# Altium schematic sheet USB_PER1.SchDoc
size 594 x 420 mm; SheetNumber: 15; SheetTotal: 20
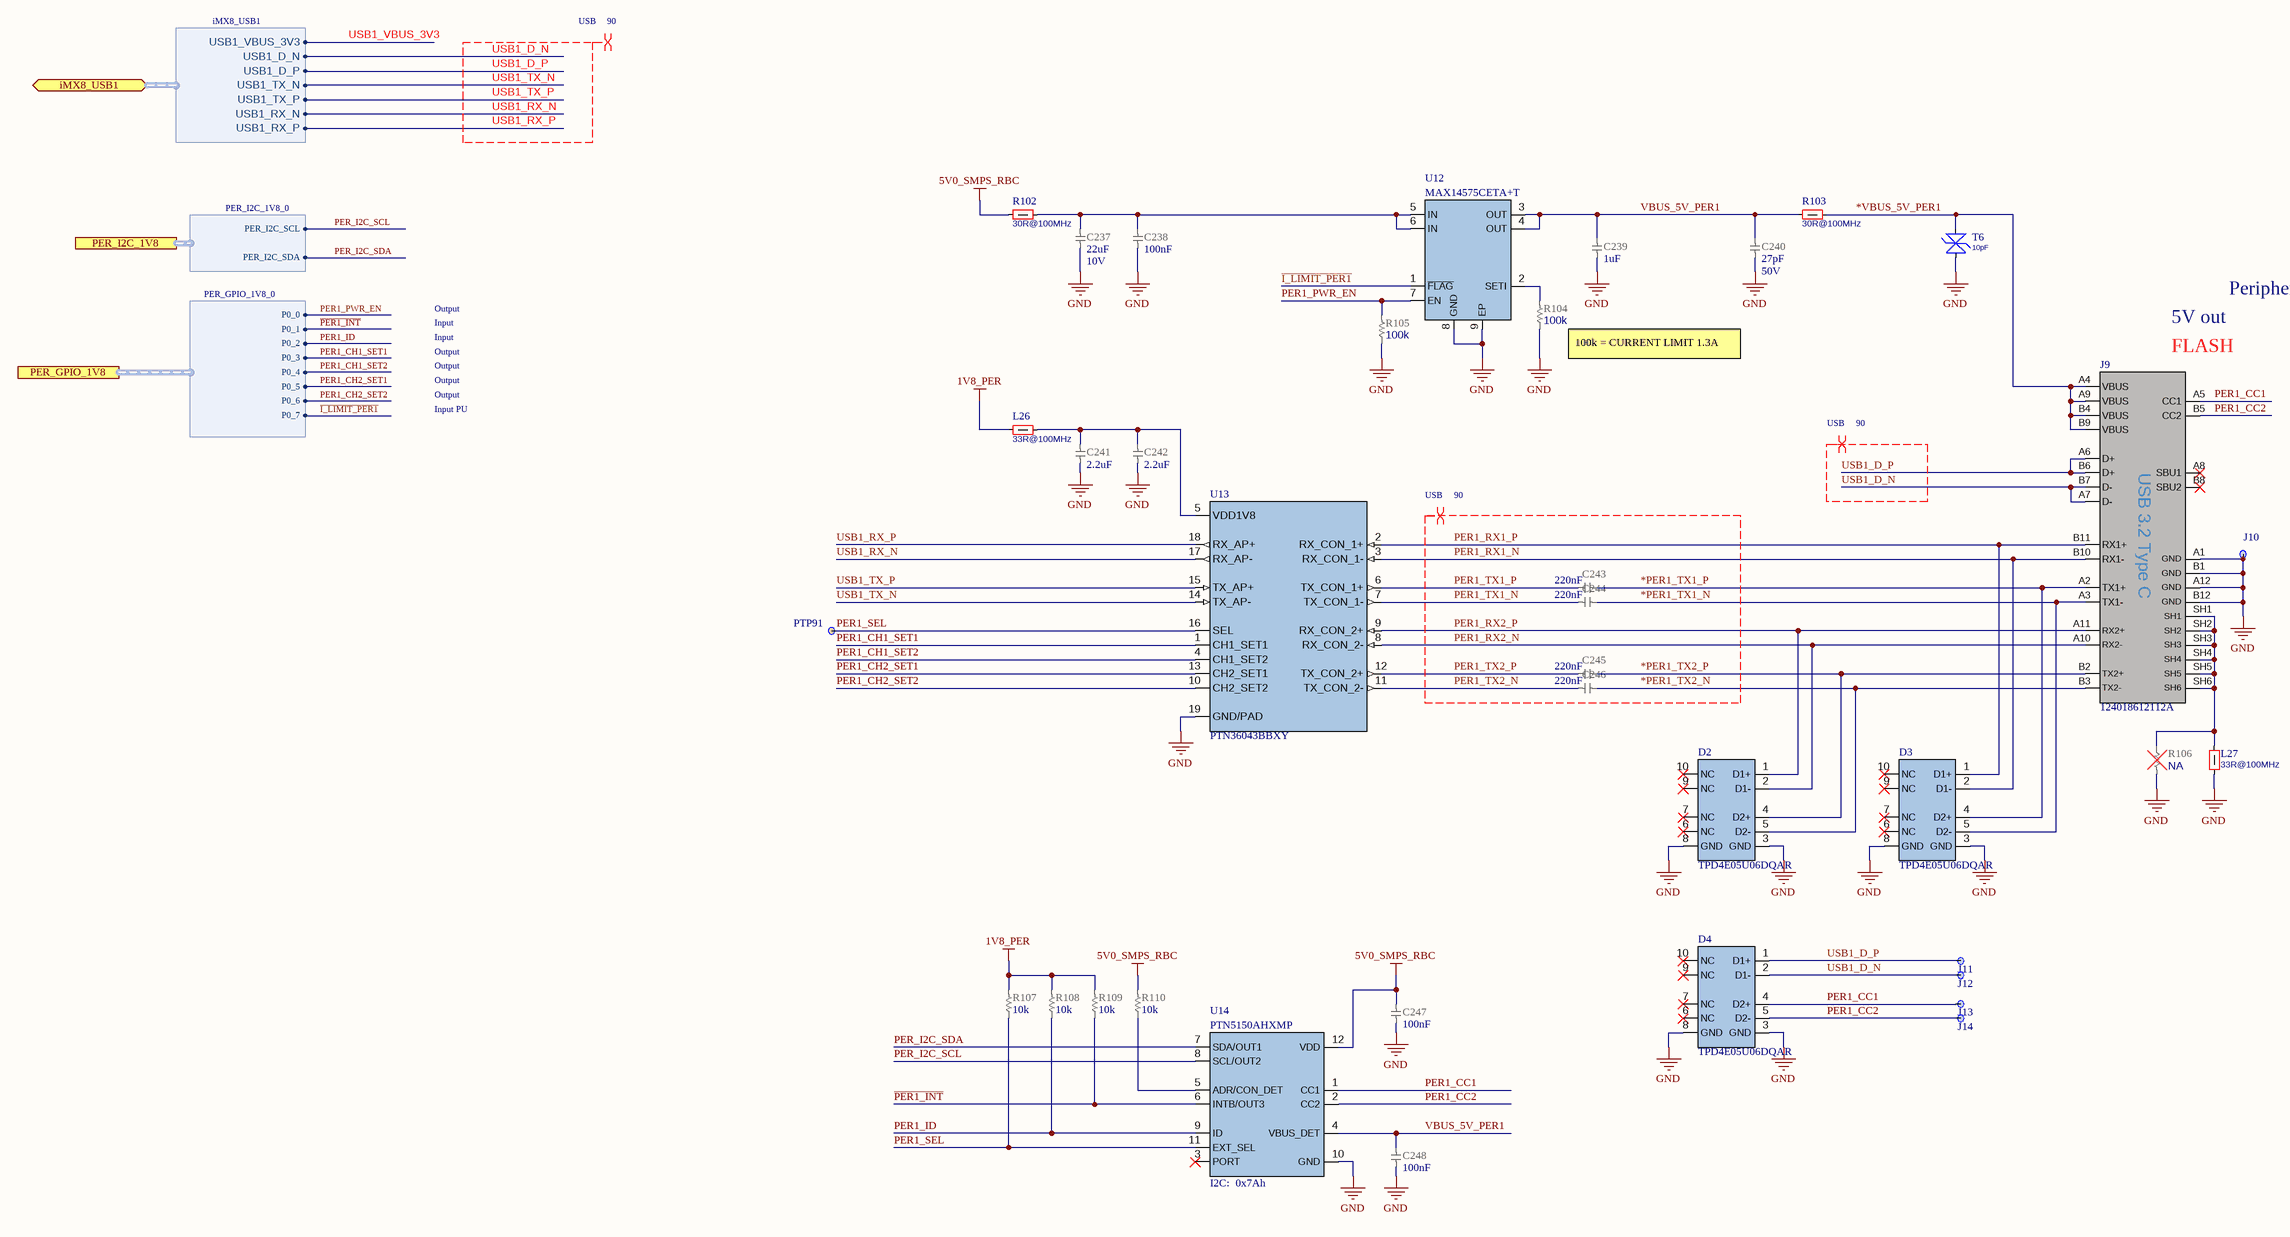
[diagram p0: USB_PER1.SchDoc]

## Parts
C237  value 22uF  Voltage: 10V  [CAP_0805_UN1Q]  (hidden comment: CAP_0805_22uF_10V_X7R)
C238  value 100nF  [CAP_0201_UN1Q]  (hidden comment: CAP_0201_100n_X7S_16V)
C239  value 1uF  [CAP_0201_UN1Q]  (hidden comment: CAP_0201_1uF_X6S)
C240  value 27pF  Voltage: 50V  [CAP_0201_UN1Q]  (hidden comment: CAP_0201_27p)
C241  value 2.2uF  [CAP_0402_H09W07_UN1Q]  (hidden comment: CAP_0402_2u2_10V_X6S)
C242  value 2.2uF  [CAP_0402_H09W07_UN1Q]  (hidden comment: CAP_0402_2u2_10V_X6S)
C243  value 220nF  [CAP_0201_UN1Q]  (hidden comment: CAP_0201_220n_10V_X6S)
C244  value 220nF  [CAP_0201_UN1Q]  (hidden comment: CAP_0201_220n_10V_X6S)
C245  value 220nF  [CAP_0201_UN1Q]  (hidden comment: CAP_0201_220n_10V_X6S)
C246  value 220nF  [CAP_0201_UN1Q]  (hidden comment: CAP_0201_220n_10V_X6S)
C247  value 100nF  [CAP_0201_UN1Q]  (hidden comment: CAP_0201_100n_X7S_16V)
C248  value 100nF  [CAP_0201_UN1Q]  (hidden comment: CAP_0201_100n_X7S_16V)
D2  TPD4E05U06DQAR  [USON10_DQA_TI]
D3  TPD4E05U06DQAR  [USON10_DQA_TI]
D4  TPD4E05U06DQAR  [USON10_DQA_TI]
J9  Part Number: 124018612112A  [USB_C_AMPHENOL_124018612112A]  (hidden comment: USB_C_AMPHENOL_124018612112A)
J10  Testpoint, Surface, 1.0mm  [TP_1mm_UN1Q]  (value not drawn)  (no BOM)
J11  Testpoint, Surface, 1.0mm  [TP_1mm_UN1Q]  (value not drawn)  (no BOM)
J12  Testpoint, Surface, 1.0mm  [TP_1mm_UN1Q]  (value not drawn)  (no BOM)
J13  Testpoint, Surface, 1.0mm  [TP_1mm_UN1Q]  (value not drawn)  (no BOM)
J14  Testpoint, Surface, 1.0mm  [TP_1mm_UN1Q]  (value not drawn)  (no BOM)
L26  value 33R@100MHz  [IND_0201_UN1Q]  (hidden comment: FERRITE_0201_BLM03_33Ohm)
L27  value 33R@100MHz  [IND_0201_UN1Q]  (hidden comment: FERRITE_0201_BLM03_33Ohm)
PTP91  PTP_0.4mm  [PTP_0.4mm]  (value not drawn)  (no BOM)
R102  value 30R@100MHz  [FERR_BLM15KD]  (hidden comment: FERRITE_0402_BLM15KD)
R103  value 30R@100MHz  [FERR_BLM15KD]  (hidden comment: FERRITE_0402_BLM15KD)
R104  value 100k  [RES_0201_UN1Q]  (hidden comment: RES_0201_100k)
R105  value 100k  [RES_0201_UN1Q]  (hidden comment: RES_0201_100k)
R106  value NA  [RES_0201_UN1Q]  (hidden comment: RES_0201_NA)
R107  value 10k  [RES_0201_UN1Q]  (hidden comment: RES_0201_10k)
R108  value 10k  [RES_0201_UN1Q]  (hidden comment: RES_0201_10k)
R109  value 10k  [RES_0201_UN1Q]  (hidden comment: RES_0201_10k)
R110  value 10k  [RES_0201_UN1Q]  (hidden comment: RES_0201_10k)
T6  value 10pF  [TVS_0201_EZAEG]  (hidden comment: TVS_0201_10pF)
U12  Part Number: MAX14575CETA+T  [TDFN8-MAX14575C]  (hidden comment: MAX14575C)
U13  PTN36043BBXY  [DHX2QFN18_NXP]
U14  PTN5150AHXMP  [X2QFN12_NXP]

## Ports
iMX8_USB1 (bidir, harness iMX8_USB1), PER_GPIO_1V8 (harness PER_GPIO_1V8_0), PER_I2C_1V8 (harness PER_I2C_1V8_0)

## Harnesses
PER_I2C_1V8_0: PER_I2C_SCL, PER_I2C_SDA
PER_GPIO_1V8_0: P0_0, P0_1, P0_2, P0_3, P0_4, P0_5, P0_6, P0_7
iMX8_USB1: USB1_VBUS_3V3, USB1_D_N, USB1_D_P, USB1_TX_N, USB1_TX_P, USB1_RX_N, USB1_RX_P

## Nets
1V8_PER: L26.1 R107.2 R108.2 R109.2
5V0_SMPS_RBC: C247.1 R102.1 R110.2 U14.12(VDD)
GND: C237.1 C238.1 C239.1 C240.1 C241.2 C242.2 C247.2 C248.2 D2.3(GND) D2.8(GND) D3.3(GND) D3.8(GND) D4.3(GND) D4.8(GND) J9.A1(GND) J9.A12(GND) J9.B1(GND) J9.B12(GND) J10.1(TP) L27.2 R104.1 R105.1 R106.2 T6.1 U12.8(GND) U12.9(EP) U13.19(GND/PAD) U14.10(GND)
*PER1_TX1_N: C244.1 D3.5(D2-) J9.A3(TX1-)
*PER1_TX1_P: C243.1 D3.4(D2+) J9.A2(TX1+)
*PER1_TX2_N: C246.1 D2.5(D2-) J9.B3(TX2-)
*PER1_TX2_P: C245.1 D2.4(D2+) J9.B2(TX2+)
*VBUS_5V_PER1: J9.A4(VBUS) J9.A9(VBUS) J9.B4(VBUS) J9.B9(VBUS) R103.2 T6.2
~{I_LIMIT_PER1}: U12.1(~{FLAG}) ; port PER_GPIO_1V8.P0_7
~{PER1_INT}: R109.1 U14.6(INTB/OUT3) ; port PER_GPIO_1V8.P0_1
PER1_CC1: D4.4(D2+) J9.A5(CC1) J13.1(TP) U14.1(CC1)
PER1_CC2: D4.5(D2-) J9.B5(CC2) J14.1(TP) U14.2(CC2)
PER1_CH1_SET1: U13.1(CH1_SET1) ; port PER_GPIO_1V8.P0_3
PER1_CH1_SET2: U13.4(CH1_SET2) ; port PER_GPIO_1V8.P0_4
PER1_CH2_SET1: U13.13(CH2_SET1) ; port PER_GPIO_1V8.P0_5
PER1_CH2_SET2: U13.10(CH2_SET2) ; port PER_GPIO_1V8.P0_6
PER1_ID: R108.1 U14.9(ID) ; port PER_GPIO_1V8.P0_2
PER1_PWR_EN: R105.2 U12.7(EN) ; port PER_GPIO_1V8.P0_0
PER1_RX1_N: D3.2(D1-) J9.B10(RX1-) U13.3(RX_CON_1-)
PER1_RX1_P: D3.1(D1+) J9.B11(RX1+) U13.2(RX_CON_1+)
PER1_RX2_N: D2.2(D1-) J9.A10(RX2-) U13.8(RX_CON_2-)
PER1_RX2_P: D2.1(D1+) J9.A11(RX2+) U13.9(RX_CON_2+)
PER1_SEL: PTP91.1(TP) R107.1 U13.16(SEL) U14.11(EXT_SEL)
PER1_TX1_N: C244.2 U13.7(TX_CON_1-)
PER1_TX1_P: C243.2 U13.6(TX_CON_1+)
PER1_TX2_N: C246.2 U13.11(TX_CON_2-)
PER1_TX2_P: C245.2 U13.12(TX_CON_2+)
PER_I2C_SCL: U14.8(SCL/OUT2) ; port PER_I2C_1V8.PER_I2C_SCL
PER_I2C_SDA: U14.7(SDA/OUT1) ; port PER_I2C_1V8.PER_I2C_SDA
USB1_D_N: D4.2(D1-) J9.A7(D-) J9.B7(D-) J12.1(TP) ; port iMX8_USB1.USB1_D_N
USB1_D_P: D4.1(D1+) J9.A6(D+) J9.B6(D+) J11.1(TP) ; port iMX8_USB1.USB1_D_P
USB1_RX_N: U13.17(RX_AP-) ; port iMX8_USB1.USB1_RX_N
USB1_RX_P: U13.18(RX_AP+) ; port iMX8_USB1.USB1_RX_P
USB1_TX_N: U13.14(TX_AP-) ; port iMX8_USB1.USB1_TX_N
USB1_TX_P: U13.15(TX_AP+) ; port iMX8_USB1.USB1_TX_P
USB1_VBUS_3V3: port iMX8_USB1.USB1_VBUS_3V3
VBUS_5V_PER1: C239.2 C240.2 C248.1 R103.1 U12.3(OUT) U12.4(OUT) U14.4(VBUS_DET)
NetC237_2: C237.2 C238.2 R102.2 U12.5(IN) U12.6(IN)
NetC241_1: C241.1 C242.1 L26.2 U13.5(VDD1V8)
NetJ9_SH1: J9.SH1 J9.SH2 J9.SH3 J9.SH4 J9.SH5 J9.SH6 L27.1 R106.1
NetR104_2: R104.2 U12.2(SETI)
NetR110_1: R110.1 U14.5(ADR/CON_DET)

Not connected (* = marked no-connect by the designer): D2 6(NC)* 7(NC)* 9(NC)* 10(NC)*; D3 6(NC)* 7(NC)* 9(NC)* 10(NC)*; D4 6(NC)* 7(NC)* 9(NC)* 10(NC)*; J9 A8(SBU1)* B8(SBU2)*; U14 3(PORT)*

## Layout directives
differential pair; differential pair class 90; net class USB; rule Matched Net Lengths [Tolerance = 0.3mm]: *PER1_TX1_N, *PER1_TX1_P, *PER1_TX2_N, *PER1_TX2_P, PER1_RX1_N, PER1_RX1_P, PER1_RX2_N, PER1_RX2_P, PER1_TX1_N, PER1_TX1_P, PER1_TX2_N, PER1_TX2_P, USB1_D_N, USB1_D_P, USB1_RX_N, USB1_RX_P, USB1_TX_N, USB1_TX_P

## Notes on the sheet
- Output
- Peripheral Connector 1
- Input
- (near R104) 100k = CURRENT LIMIT 1.3A
- 5V out
- (near J9) FLASH
- Input PU
- (near U14) I2C:  0x7Ah
- DWG NO:
- REV:
- THIS DOCUMENT AND THE DATA DISCLOSED HEREIN OR
- HEREWITH IS THE PROPERTY OF ALTIUM LIMITED AND MAY
- BE FREELY DISTRIBUTED IN WHOLE. NO RIGHTS ARE
- RESERVED OR EXPRESS OR IMPLIED WARANTEE GIVEN.
- REVISION
- DESCRIPTION
- DATE
- APPROVED
- ENG:
- APPROVALS
- PROJECT
- DSN:
- CHK:
- REFERENCE DOCUMENTS
- PROJECT REVISION:
- TITLE
- DOCUMENT REVISION:
- DESIGN ITEM:
- BOM:
- FAB DWG:
- PCB DWG:
- ASSY DWG:
- SCALE:
- A2
- SIZE
- CAGE CODE
- FILE NAME
- DWG NO.
- SHEET
- OF
- REV
- (in symbol CMP-001-001438-8) USB 3.2 Type C

## Library data of the parts
C237 = CMP-001-000892-11: CAP; Part Number: GRM21BZ71A226ME15L; Manufacturer: Murata; Tolerance: +/-20%; Alternative component: Allowed; Sort order: 308; Temperature characteristics: X7R; System: RLC; HasBeenBuilt: TBD; Creation date: 22032024; ComponentLink4Description: 4_X-information; ComponentLink1Description: 1_Datasheet; ComponentLink3Description: 3_X-information; ComponentLink2Description: 2_Product page; Package: 0805; Manufacturer Part Number: GRM21BZ71A226ME15L; Component Type: Capacitor
C238 C247 C248 = CMP-001-000385-16: CAP; Part Number: GRM033C71C104KE14D; Manufacturer: Murata; Temperature characteristics: X7S; Tolerance: +/-10%; Sort order: 302; HasBeenBuilt: TBD; Alternative component: Allowed; Voltage: 16V; System: RLC; Package: 0201; ClassName: SMALL; ComponentLink1Description: 1_Datasheet; ComponentLink2Description: 2_Product page; ComponentLink3Description: 3_X-information; ComponentLink4Description: 4_X-information; Creation date: 20190101; Source: RLC_UN1Q.SchLib; Manufacturer Part Number: GRM033C71C104KE14D; Component Type: Capacitor
C239 = CMP-001-000336-15: CAP; Part Number: KGM03CS61A105MH; Manufacturer: Kyocera; Manufacturer: KYOCERA AVX; Temperature characteristics: X6S; Voltage: 10V; Tolerance: +/-20%; Sort order: 302; HasBeenBuilt: False; Alternative component: Allowed; System: RLC; Package: 0201; Operating temperature range: -55C to +105C; ClassName: SMALL; ComponentLink1Description: 1_Datasheet; ComponentLink2Description: 2_Product page; ComponentLink3Description: 3_X-information; ComponentLink4Description: 4_X-information; Creation date: 20190101; Source: RLC_UN1Q.SchLib; Manufacturer Part Number: KGM03CS61A105MH; Component Type: Capacitor
C240 = CMP-001-000280-15: CAP; Part Number: GRM0335C1H270JA01D; Manufacturer: TDK; Manufacturer: Murata; Temperature characteristics: C0G; Tolerance: +/-5%; Sort order: 302; HasBeenBuilt: TBD; Alternative component: Allowed; System: RLC; Package: 0201; ComponentLink1Description: 1_Datasheet; ComponentLink2Description: 2_Product page; ComponentLink3Description: 3_X-information; ComponentLink4Description: 4_X-information; Creation date: 20190101; ClassName: SMALL; Source: RLC_UN1Q.SchLib; Manufacturer Part Number: GRM0335C1H270JA01D; Component Type: Capacitor
C241 C242 = CMP-001-000887-10: CAP; Part Number: GRM155C81A225KE44D; Manufacturer: Murata; Temperature characteristics: X6S; Voltage: 10V; Tolerance: +/-10%; Sort order: 304; Alternative component: Allowed; System: RLC; Package: 0402; ComponentLink1Description: 1_Datasheet; ComponentLink2Description: 2_Product page; ComponentLink3Description: 3_X-information; ComponentLink4Description: 4_X-information; Creation date: 20190101; Manufacturer Part Number: GRM155C81A225KE44D; Component Type: Capacitor
C243-C246 = CMP-001-000889-11: CAP; Part Number: GRM033C81A224KE01D; Manufacturer: Murata; Temperature characteristics: X6S; Voltage: 10V; Tolerance: +/-20%; Sort order: 302; HasBeenBuilt: TBD; Alternative component: Allowed; System: RLC; Package: 0201; Dimensions WxLxH: 0.35; ComponentLink1Description: 1_Datasheet; ComponentLink2Description: 2_Product page; ComponentLink3Description: 3_X-information; ComponentLink4Description: 4_X-information; Creation date: 26042024; ClassName: SMALL; Manufacturer Part Number: GRM033C81A224KE01D; Component Type: Capacitor
D2-D4 = CMP-001-000916-4: 4-CH Low-Capacitance ESD Diode; Manufacturer: Texas Instruments; HasBeenBuilt: Saluki3_HW_RIB_2; Sort order: 405; System: IC; ComponentLink1Description: 1_Datasheet; ComponentLink1URL: http://www.ti.com/lit/gpn/tpd4e05u06; ComponentLink2Description: 2_Product page; ComponentLink2URL: https://www.ti.com/product/TPD4E05U06; ComponentLink3Description: 3_X-information; ComponentLink4Description: 4_X-information; Creation date: 20210927; Dimensions WxLxH: 2.5x1.0x0.55; Operating temperature range: -40... +125 °C; Package: USON10; Part Number: TPD4E05U06DQAR; ECCN: EAR99; RoHS: RoHS3; Source: UUDET_KOMPONENTIT.SchLib; Manufacturer Part Number: TPD4E05U06DQAR; Component Type: ESD & EMI
J9 = CMP-001-001438-8: USB3.2 GEN1, Type C, Top mount, CH 1.50mm, Dual Row SMT, IPX8; Manufacturer Part Number: 12402082E512A; Sort order: 101; System: Connector; ClassName: BIG; ComponentLink1Description: 1_Datasheet; ComponentLink1URL: https://cdn.amphenol-cs.com/media/wysiwyg/files/documentation/datasheet/inputoutput/io_usb_type_c.pdf; ComponentLink2Description: 2_Product page; ComponentLink2URL: https://www.amphenol-cs.com/product/124018612112a.html; ComponentLink3Description: 3_X-information; ComponentLink4Description: 4_X-information; Operating temperature range: -40C to +85C; Creation date: 20250617; Manufacturer: Amphenol; ECCN: EAR99; Design Item ID: USB_C_AMPHENOL_124018612112A; RoHS: RoHS 3; Component Type: Interface Connector
J10-J14 = CMP-001-000153-12: Testpoint 1.0mm; Part Number: TP 1mm; Sort order: -; HasBeenBuilt: -; ClassName: SMALL; ComponentLink1Description: 1_Datasheet; ComponentLink2Description: 2_Product page; ComponentLink3Description: 3_X-information; ComponentLink4Description: 4_X-information; Creation date: 20200101; System: Test Point; Design Item ID: TP_1mm; Source: Conn_UN1Q.SchLib
  J11-J14: Component Type: Test Point
L26 L27 = CMP-001-000744-7: FERRITE; Manufacturer: Murata; Part Number: BLM03PG330SN1; Tolerance: 25%; Sort order: 362; HasBeenBuilt: TBD; System: Discrete; Package: 0201; Operating temperature range: -55 ... +125C; ClassName: SMALL; ComponentLink1Description: 1_Datasheet; ComponentLink1URL: https://www.murata.com/en-us/products/productdetail.aspx?cate=luNoiseSupprFilteChipFerriBead&partno=BLM03PG330SN1%23; ComponentLink2Description: 2_Product page; ComponentLink3Description: 3_X-information; ComponentLink4Description: 4_X-information; Creation date: 20200304; Source: Discrete_UN1Q.SchLib; Manufacturer Part Number: BLM03PG330SN1; Component Type: Ferrite
PTP91 = CMP-001-001296-3: Production Testpoint 0.4mm. Flying probe. Use 1mm pitch.; Part Number: PTP 0.4mm; ComponentLink4Description: 4_X-information; ComponentLink1Description: 1_Datasheet; Sort order: -; ClassName: SMALL; System: Test Point; HasBeenBuilt: -; Design Item ID: PTP_0.4mm; ComponentLink3Description: 3_X-information; Creation date: 20240909; ComponentLink2Description: 2_Product page; Component Type: Test Point
R102 R103 = CMP-001-000738-12: FERRITE; Part Number: BLM15KD300SN1; Manufacturer: Murata; Manufacturer Part Number: BLM15KD300SN1D; Sort order: 364; HasBeenBuilt: Saluki2; System: Discrete; Current: 3.1A; Package: 0402; Operating temperature range: -55 ... +125C; Dimensions WxLxH: 0.55mm; ComponentLink1Description: 1_Datasheet; ComponentLink1URL: https://www.murata.com/en-us/products/productdetail.aspx?cate=luNoiseSupprFilteChipFerriBead&partno=BLM15KD300SN1%23; ComponentLink2Description: 2_Product page; ComponentLink3Description: 3_X-information; ComponentLink4Description: 4_X-information; Creation date: 20200304; Source: Discrete_UN1Q.SchLib; ECCN: EAR99; RoHS: RoHS3; Component Type: Ferrite
R104 R105 = CMP-001-000526-11: RES; Part Number: RC0201FR-07100KL; Manufacturer: YAGEO; Tolerance: 1%; Power Rating: 1/20W; Sort order: 322; HasBeenBuilt: TBD; Alternative component: Allowed; System: RLC; Package: 0201; ClassName: SMALL; ComponentLink1Description: 1_Datasheet; ComponentLink2Description: 2_Product page; ComponentLink3Description: 3_X-information; ComponentLink4Description: 4_X-information; Creation date: 20190101; Source: RLC_UN1Q.SchLib; Component Type: Resistor
R106 = CMP-001-000434-10: Not Assembled - RES; Sort order: 999; HasBeenBuilt: TBD; System: RLC; Package: 0201; ClassName: SMALL; ComponentLink1Description: 1_Datasheet; ComponentLink2Description: 2_Product page; ComponentLink3Description: 3_X-information; ComponentLink4Description: 4_X-information; Creation date: 20190101; Source: RLC_UN1Q.SchLib; Component Type: Resistor
R107-R110 = CMP-001-000446-13: RES; Part Number: RC0201FR-0710KL; Manufacturer: YAGEO; Power Rating: 1/20W; Sort order: 322; HasBeenBuilt: TBD; Tolerance: 1%; Alternative component: Allowed; System: RLC; Package: 0201; ClassName: SMALL; ComponentLink1Description: 1_Datasheet; ComponentLink2Description: 2_Product page; ComponentLink3Description: 3_X-information; ComponentLink4Description: 4_X-information; Creation date: 20190101; Source: RLC_UN1Q.SchLib; Component Type: Resistor
T6 = CMP-001-000756-6: ESD Protection  TVS Diodes SMP Diode 0201 5vdc 10 pf <8v clamp@1a; Part Number: GG020105100N2P; Manufacturer: TDK; Voltage: 5.5V; Sort order: 402; HasBeenBuilt: TBD; System: Discrete; Package: 0201; Operating temperature range: -40 ... +85C; Dimensions WxLxH: tbd; ComponentLink1Description: 1_Datasheet; ComponentLink1URL: https://www2.mouser.com/datasheet/2/40/AVX_GiGuard-1101674.pdf; ComponentLink2Description: 2_Product page; ComponentLink3Description: 3_X-information; ComponentLink4Description: 4_X-information; Creation date: 20211207; ClassName: SMALL; Source: Discrete_UN1Q.SchLib; Manufacturer Part Number: GG020105100N2P; Component Type: ESD & EMI
U12 = CMP-001-000798-6: ADJ. CURRENT-LIMITED POWER SWITCH, 2.5A; Manufacturer: Maxim Integrated; System: IC; HasBeenBuilt: SleeveIO_01; Sort order: 457; ClassName: BIG; Dimensions WxLxH: 2.05 mm x 2.05 mm x 0.8 mm; ComponentLink4Description: 4_X-information; Design Item ID: MAX14575C; Operating temperature range: -40 ... +85 °C; ComponentLink3Description: 3_X-information; Package: TDFN8; ComponentLink1URL: https://www.analog.com/media/en/technical-documentation/data-sheets/MAX14575A-MAX14575C.pdf; ComponentLink1Description: 1_Datasheet; ComponentLink2Description: 2_Product page; ComponentLink2URL: https://www.analog.com/en/products/max14575c.html; Creation date: 20211018; Source: IC_UN1Q.SchLib
U13 = CMP-001-001164-4: USB3.1 Gen1 Type-C Superspeed Active Signal Switch; Manufacturer: NXP; Manufacturer: Knowles; Manufacturer Part Number: 1825J0100820FCT; Sort order: 501; System: IC; Dimensions WxLxH: 2.4 x 2.0 x 0.35mm; Operating temperature range: -40C ... +85C; Part Number: PTN36043BBXY; ComponentLink3URL: https://www.nxp.com/design/design-center/development-boards-and-designs/analog-toolbox/ptn5150a-ptn36043-usb-type-c-cc-logic-evaluation-kit:OM13584; Package: DHX2QFN18; ComponentLink1URL: https://www.nxp.com/docs/en/data-sheet/PTN36043B.pdf; ComponentLink2Description: 2_Product page; Creation date: 20250417; ComponentLink3Description: 3_EVA kit; ComponentLink1Description: 1_Datasheet; ComponentLink4Description: 4_X-information; Component Type: Logic
U14 = CMP-076-000050-6: CC logic for USB Type-C applications; Manufacturer: NXP; Sort order: 501; System: IC; HasBeenBuilt: SALUKI_V2; Operating temperature range: -40C ... +85C; Design Item ID: PTN5150AHXMP; ComponentLink3Description: 3_X-information; ComponentLink1Description: 1_Datasheet; Package: X2QFN12; Source: IC_UN1Q.SchLib; ComponentLink4Description: 4_X-information; Dimensions WxLxH: 1.6x1.6x0.4mm; ComponentLink1URL: https://www.nxp.com/docs/en/data-sheet/PTN5150A.pdf; ComponentLink2Description: 2_Product page; ComponentLink2URL: https://www.nxp.com/part/PTN5150AHX#/; Creation date: 20220314; Part Number: PTN5150AHXMP